# EAGLE schematic lmzmv1_0 (EAGLE 9.6.2)
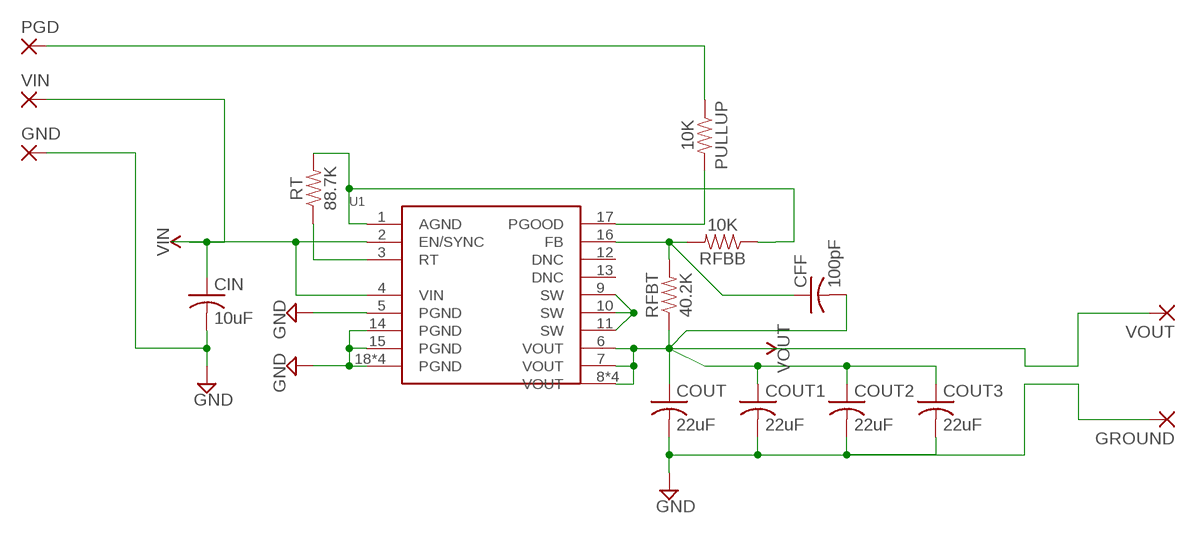
[diagram p0: schematic, sheet 1]

## Parts
CFF  100pF  C-USC0603  [C0603]
CIN  10uF  C-USC1206  [C1206]
COUT  22uF  C-USC0805  [C0805]
COUT1  22uF  C-USC0805  [C0805]
COUT2  22uF  C-USC0805  [C0805]
COUT3  22uF  C-USC0805  [C0805]
GND  SMD5  [SMD2,54-5,08]
GROUND  SMD5  [SMD2,54-5,08]
PGD  SMD5  [SMD2,54-5,08]
PULLUP  10K  RESISTOR0603  [0603]
RFBB  10K  RESISTOR0603  [0603]
RFBT  40.2K  RESISTOR0603  [0603]
RT  88.7K  RESISTOR0603  [0603]
U1  LMZM_MODULEQFN18TI  [QFN-18]
VIN  SMD5  [SMD2,54-5,08]
VOUT  SMD5  [SMD2,54-5,08]

## Nets
AGND: RFBB.1 RT.2 U1.1(AGND)
FB: CFF.1 RFBB.2 RFBT.2 U1.16(FB)
GND: CIN.2 COUT1.2 COUT2.2 COUT3.2 COUT.2 GND.1(P) GROUND.1(P) U1.5(PGND) U1.14(PGND) U1.15(PGND) U1.18(PGND) U1.W1(PGND) U1.W2(PGND) U1.W(PGND)
PGOOD: PULLUP.2 U1.17(PGOOD)
RT: RT.1 U1.3(RT)
SW: U1.9(SW) U1.10(SW) U1.11(SW)
TPGOOD: PGD.1(P) PULLUP.1
VIN: CIN.1 U1.2(EN/SYNC) U1.4(VIN) VIN.1(P)
VOUT: CFF.2 COUT1.1 COUT2.1 COUT3.1 COUT.1 RFBT.1 U1.6(VOUT) U1.7(VOUT) U1.8(VOUT) U1.X1(VOUT) U1.X2(VOUT) U1.X(VOUT) VOUT.1(P)
Unconnected: U1.12(DNC) U1.13(DNC)

## Library data of the parts
CFF = adafruit:C-US: CAPACITOR, American symbol; MF: YAGEO; MPN: CC0603JRNPO9BN101; OC_NEWARK: 68R4713
CIN = adafruit:C-US: CAPACITOR, American symbol; MF: TAIYO YUDEN; MPN: LMK107BJ106MALTD; OC_NEWARK: 84R9134
COUT COUT1-COUT3 = adafruit:C-US: CAPACITOR, American symbol; MF: AVX; MPN: F980G226MMA; OC_NEWARK: 84R8910
GND GROUND PGD VIN VOUT = wirepad:SMD5: SMD PAD
PULLUP RFBB = SparkFun-Resistors:RESISTOR: Generic Resistor Package; MF: YAGEO; MPN: RC0603FR-0710KL; OC_NEWARK: 68R0049
RFBT = SparkFun-Resistors:RESISTOR: Generic Resistor Package; MF: MULTICOMP PRO; MPN: MC0603SAF4022T5E; OC_NEWARK: 04P0417
RT = SparkFun-Resistors:RESISTOR: Generic Resistor Package; MF: PANASONIC; MPN: ERJ-S03D8872V; OC_NEWARK: 65AC7547
U1 = lmzm33603:LMZM_MODULE; MPN: LMZM33603RLRR; OC_NEWARK: unknown